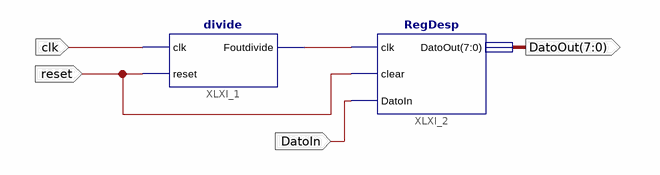
[diagram p0: schematic sheet 1]
// Xilinx ISE schematic SuperiorRegDespla.sch (spartan6) as structural Verilog: 2 symbols, 4 ports
module SuperiorRegDespla (
  input  clk,
  input  reset,
  input  DatoIn,
  output [7:0] DatoOut
);

  wire XLXN_4;

  divide XLXI_1 (.clk(clk), .reset(reset), .Foutdivide(XLXN_4));
  RegDesp XLXI_2 (.clk(XLXN_4), .clear(reset), .DatoIn(DatoIn), .DatoOut(DatoOut));
endmodule
